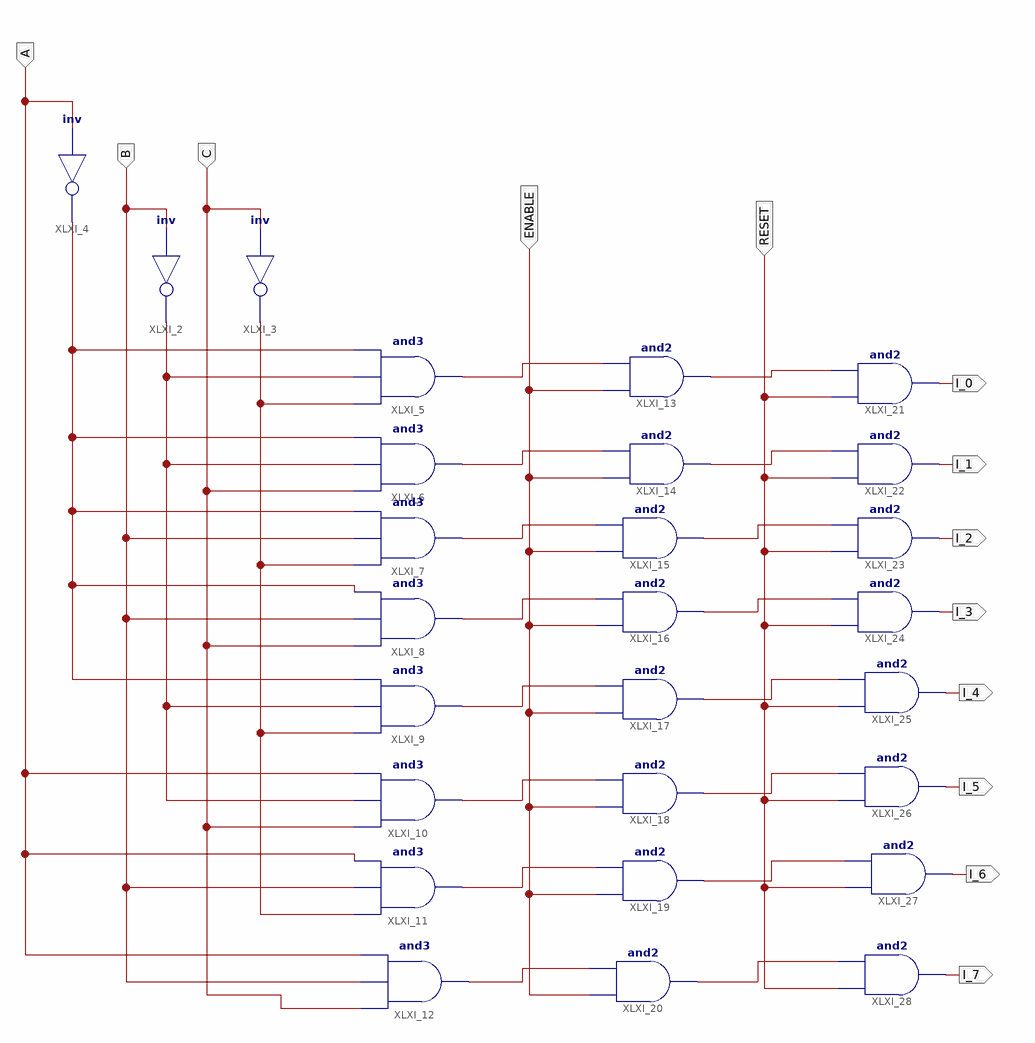
[diagram p0: schematic sheet 1]
// Xilinx ISE schematic DECODER.sch (artix7) as structural Verilog: 27 symbols, 13 ports
module DECODER (
  input  A,
  input  B,
  input  C,
  input  ENABLE,
  input  RESET,
  output I_7,
  output I_6,
  output I_5,
  output I_4,
  output I_3,
  output I_2,
  output I_1,
  output I_0
);

  wire XLXN_5, XLXN_6, XLXN_13, XLXN_16, XLXN_17, XLXN_18, XLXN_19, XLXN_20, XLXN_21, XLXN_22, XLXN_23,
       XLXN_25, XLXN_26, XLXN_27, XLXN_28, XLXN_29, XLXN_30, XLXN_31, XLXN_32;

  not XLXI_2 (XLXN_5, B);
  not XLXI_3 (XLXN_6, C);
  not XLXI_4 (XLXN_13, A);
  and XLXI_5 (XLXN_16, XLXN_6, XLXN_5, XLXN_13);
  and XLXI_6 (XLXN_17, C, XLXN_5, XLXN_13);
  and XLXI_7 (XLXN_18, XLXN_6, B, XLXN_13);
  and XLXI_8 (XLXN_19, C, B, XLXN_13);
  and XLXI_9 (XLXN_20, XLXN_6, XLXN_5, XLXN_13);
  and XLXI_10 (XLXN_21, C, XLXN_5, A);
  and XLXI_11 (XLXN_22, XLXN_6, B, A);
  and XLXI_12 (XLXN_23, C, B, A);
  and XLXI_13 (XLXN_25, ENABLE, XLXN_16);
  and XLXI_14 (XLXN_26, ENABLE, XLXN_17);
  and XLXI_15 (XLXN_27, ENABLE, XLXN_18);
  and XLXI_16 (XLXN_28, ENABLE, XLXN_19);
  and XLXI_17 (XLXN_29, ENABLE, XLXN_20);
  and XLXI_18 (XLXN_30, ENABLE, XLXN_21);
  and XLXI_19 (XLXN_31, ENABLE, XLXN_22);
  and XLXI_20 (XLXN_32, ENABLE, XLXN_23);
  and XLXI_21 (I_0, RESET, XLXN_25);
  and XLXI_22 (I_1, RESET, XLXN_26);
  and XLXI_23 (I_2, RESET, XLXN_27);
  and XLXI_24 (I_3, RESET, XLXN_28);
  and XLXI_25 (I_4, RESET, XLXN_29);
  and XLXI_26 (I_5, RESET, XLXN_30);
  and XLXI_27 (I_6, RESET, XLXN_31);
  and XLXI_28 (I_7, RESET, XLXN_32);
endmodule
